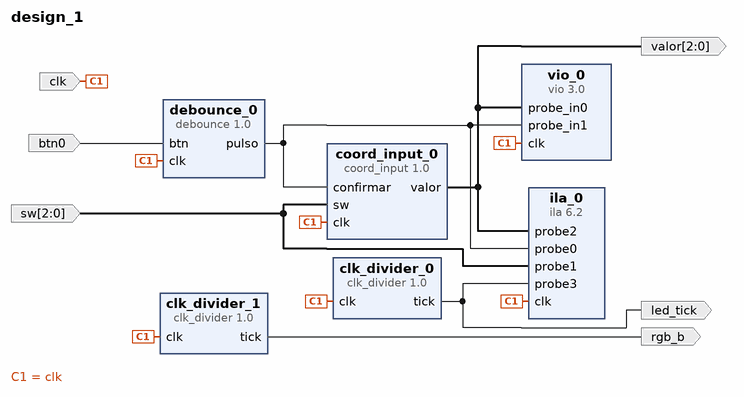
[diagram p0: block diagram of the top level]
# Vivado block design design_1, xc7z010clg400-1, Vivado 2020.1
create_bd_design design_1

create_bd_port -dir I -type clk clk
create_bd_port -dir O led_tick
create_bd_port -dir I btn0
create_bd_port -dir I -from 2 -to 0 sw
create_bd_port -dir O -from 2 -to 0 valor
create_bd_port -dir O rgb_b

create_bd_cell -type ip -vlnv xilinx.com:user:clk_divider:1.0 clk_divider_0
create_bd_cell -type ip -vlnv xilinx.com:user:debounce:1.0 debounce_0
create_bd_cell -type ip -vlnv xilinx.com:user:coord_input:1.0 coord_input_0
create_bd_cell -type ip -vlnv xilinx.com:user:clk_divider:1.0 clk_divider_1
set_property -dict {CONFIG.DIV 15625000} [get_bd_cells clk_divider_1]
create_bd_cell -type ip -vlnv xilinx.com:ip:vio:3.0 vio_0
set_property -dict {CONFIG.C_NUM_PROBE_IN 2} [get_bd_cells vio_0]
create_bd_cell -type ip -vlnv xilinx.com:ip:ila:6.2 ila_0
set_property -dict [list \
  CONFIG.C_ENABLE_ILA_AXI_MON false \
  CONFIG.C_MONITOR_TYPE Native \
  CONFIG.C_NUM_OF_PROBES 4 \
  CONFIG.C_PROBE1_WIDTH 3 \
  CONFIG.C_PROBE2_WIDTH 3 \
] [get_bd_cells ila_0]

# ---- connections ----

connect_bd_net -net clk_0_1 [get_bd_ports clk] \
  [get_bd_pins clk_divider_0/clk] [get_bd_pins debounce_0/clk] [get_bd_pins coord_input_0/clk] \
  [get_bd_pins clk_divider_1/clk] [get_bd_pins ila_0/clk] [get_bd_pins vio_0/clk]
connect_bd_net [get_bd_pins clk_divider_0/tick] [get_bd_ports led_tick] [get_bd_pins ila_0/probe3]
connect_bd_net -net btn_0_1 [get_bd_ports btn0] [get_bd_pins debounce_0/btn]
connect_bd_net [get_bd_pins debounce_0/pulso] [get_bd_pins coord_input_0/confirmar] [get_bd_pins ila_0/probe0] [get_bd_pins vio_0/probe_in1]
connect_bd_net -net sw_0_1 [get_bd_ports sw] [get_bd_pins coord_input_0/sw] [get_bd_pins ila_0/probe1]
connect_bd_net [get_bd_pins coord_input_0/valor] [get_bd_ports valor] [get_bd_pins ila_0/probe2] [get_bd_pins vio_0/probe_in0]
connect_bd_net [get_bd_pins clk_divider_1/tick] [get_bd_ports rgb_b]

validate_bd_design
save_bd_design
